# Altium project Tx_TFT_PCB.PrjPcb (part 1 of 2)
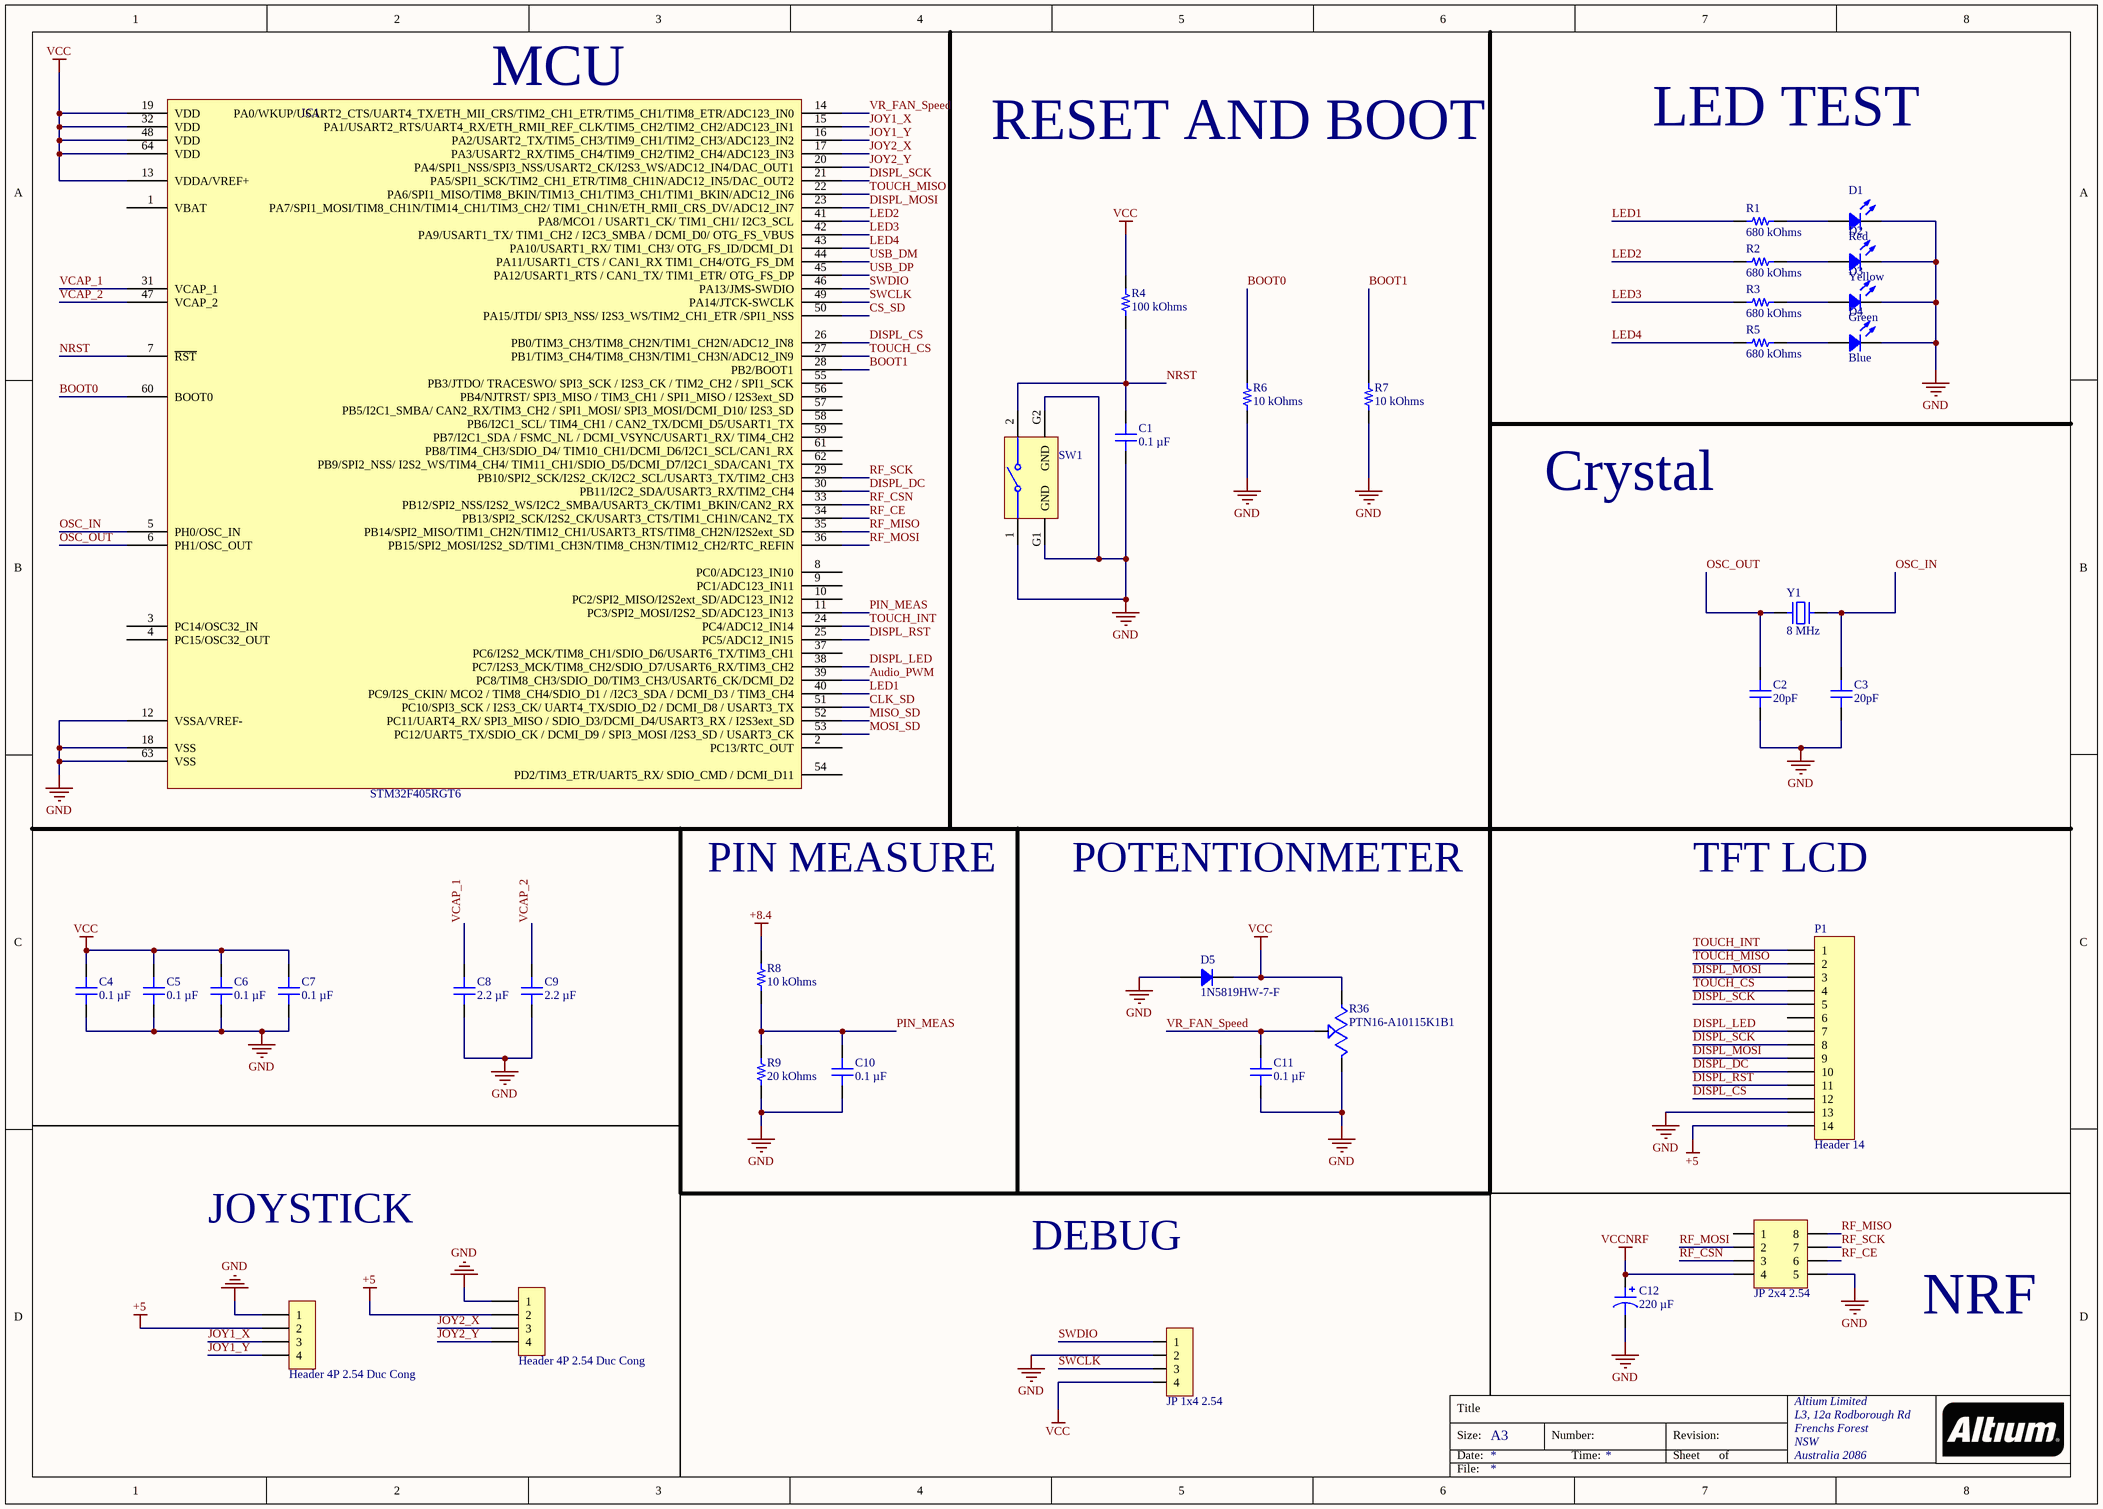
[diagram p0: MAIN_TX.SchDoc]
4 sheets, 107 parts. Net scope: global (net labels, ports and power ports of the same name join across sheets).
Board files: TX_PCB.PcbDoc, OFFICIAL_TX.PcbDoc
Sheets:
  MAIN_TX.SchDoc
  Audio.SchDoc
  Power_2.SchDoc
  USB_C.SchDoc

## Sheet MAIN_TX.SchDoc
size A3; Organization: Altium Limited; Address1: L3, 12a Rodborough Rd; Address2: Frenchs Forest; Address3: NSW; Address4: Australia 2086

### Parts
C1  0.1 µF  [CAP 0603_1608]
C2  20pF  [CAP 0603_1608]
C3  20pF  [CAP 0603_1608]
C4  0.1 µF  [CAP 0603_1608]
C5  0.1 µF  [CAP 0603_1608]
C6  0.1 µF  [CAP 0603_1608]
C7  0.1 µF  [CAP 0603_1608]
C8  2.2 µF  [CAP 0603_1608]
C9  2.2 µF  [CAP 0603_1608]
C10  0.1 µF  [CAP 0603_1608]
C11  0.1 µF  [CAP 0603_1608]
C12  220 µF  [CAP ALSMD 6.6MM H6.1MM]
D1  Red  [LED 0603_1608 RED]
D2  Yellow  [LED 0603_1608 YELLOW]
D3  Green  [LED 0603_1608 GREEN]
D4  Blue  [LED 0603_1608 BLUE]
D5  1N5819HW-7-F  [SOD-123]
H2  Header 4P 2.54 Duc Cong  [Header 4P DC 2.54]
H3  Header 4P 2.54 Duc Cong  [Header 4P DC 2.54]
IC1  STM32F405RGT6  [ST LQFP-64 10X10MM]
JP1  JP 2x4 2.54  [JP 2x4 CT]
JP4  JP 1x4 2.54  [JP 1x4 CC]
P1  Header 14  [HDR1X14]
R1  680 kOhms  [RES 0603_1608]
R2  680 kOhms  [RES 0603_1608]
R3  680 kOhms  [RES 0603_1608]
R4  100 kOhms  [RES 0603_1608]
R5  680 kOhms  [RES 0603_1608]
R6  10 kOhms  [RES 0603_1608]
R7  10 kOhms  [RES 0603_1608]
R8  10 kOhms  [RES 0603_1608]
R9  20 kOhms  [RES 0603_1608]
R36  PTN16-A10115K1B1  [POT_PTN16-A10115K1B1]
SW1  431256083716  [4312560837x6]  (value not drawn)
Y1  8 MHz  [NDK NX5032GA]

### Nets
+5: H2.2 H3.2 P1.14
+8.4: R8.2
GND: C1.1 C2.1 C3.1 C4.1 C5.1 C6.1 C7.1 C8.1 C9.1 C10.1 C11.1 C12.2 D1.2 D2.2 D3.2 D4.2 D5.1 H2.1 H3.1 IC1.12(VSSA/VREF-) IC1.18(VSS) IC1.63(VSS) JP1.5 JP4.2 P1.13 R6.1 R7.1 R9.1 R36.3 SW1.1 SW1.G1(GND) SW1.G2(GND)
VCC: C4.2 C5.2 C6.2 C7.2 D5.2 IC1.13(VDDA/VREF+) IC1.19(VDD) IC1.32(VDD) IC1.48(VDD) IC1.64(VDD) JP4.4 R4.2 R36.1
VCCNRF: C12.1 JP1.4
Audio_PWM: IC1.39(PC8/TIM8_CH3/SDIO_D0/TIM3_CH3/USART6_CK/DCMI_D2)
BOOT0: IC1.60(BOOT0) R6.2
BOOT1: IC1.28(PB2/BOOT1) R7.2
CLK_SD: IC1.51(PC10/SPI3_SCK_/_I2S3_CK/_UART4_TX/SDIO_D2_/_DCMI_D8_/_USART3_TX)
CS_SD: IC1.50(PA15/JTDI/_SPI3_NSS/_I2S3_WS/TIM2_CH1_ETR_/SPI1_NSS)
DISPL_CS: IC1.26(PB0/TIM3_CH3/TIM8_CH2N/TIM1_CH2N/ADC12_IN8) P1.12
DISPL_DC: IC1.30(PB11/I2C2_SDA/USART3_RX/TIM2_CH4) P1.10
DISPL_LED: IC1.38(PC7/I2S3_MCK/TIM8_CH2/SDIO_D7/USART6_RX/TIM3_CH2) P1.7
DISPL_MOSI: IC1.23(PA7/SPI1_MOSI/TIM8_CH1N/TIM14_CH1/TIM3_CH2/_TIM1_CH1N/ETH_RMII_CRS_DV/ADC12_IN7) P1.3 P1.9
DISPL_RST: IC1.25(PC5/ADC12_IN15) P1.11
DISPL_SCK: IC1.21(PA5/SPI1_SCK/TIM2_CH1_ETR/TIM8_CH1N/ADC12_IN5/DAC_OUT2) P1.5 P1.8
JOY1_X: H3.3 IC1.15(PA1/USART2_RTS/UART4_RX/ETH_RMII_REF_CLK/TIM5_CH2/TIM2_CH2/ADC123_IN1)
JOY1_Y: H3.4 IC1.16(PA2/USART2_TX/TIM5_CH3/TIM9_CH1/TIM2_CH3/ADC123_IN2)
JOY2_X: H2.3 IC1.17(PA3/USART2_RX/TIM5_CH4/TIM9_CH2/TIM2_CH4/ADC123_IN3)
JOY2_Y: H2.4 IC1.20(PA4/SPI1_NSS/SPI3_NSS/USART2_CK/I2S3_WS/ADC12_IN4/DAC_OUT1)
LED1: IC1.40(PC9/I2S_CKIN/_MCO2_/_TIM8_CH4/SDIO_D1_/_/I2C3_SDA_/_DCMI_D3_/_TIM3_CH4) R1.1
LED2: IC1.41(PA8/MCO1_/_USART1_CK/_TIM1_CH1/_I2C3_SCL) R2.1
LED3: IC1.42(PA9/USART1_TX/_TIM1_CH2_/_I2C3_SMBA_/_DCMI_D0/_OTG_FS_VBUS) R3.1
LED4: IC1.43(PA10/USART1_RX/_TIM1_CH3/_OTG_FS_ID/DCMI_D1) R5.1
MISO_SD: IC1.52(PC11/UART4_RX/_SPI3_MISO_/_SDIO_D3/DCMI_D4/USART3_RX_/_I2S3ext_SD)
MOSI_SD: IC1.53(PC12/UART5_TX/SDIO_CK_/_DCMI_D9_/_SPI3_MOSI_/I2S3_SD_/_USART3_CK)
NRST: C1.2 IC1.7(~{RST}) R4.1 SW1.2
OSC_IN: C3.2 IC1.5(PH0/OSC_IN) Y1.2
OSC_OUT: C2.2 IC1.6(PH1/OSC_OUT) Y1.1
PIN_MEAS: C10.2 IC1.11(PC3/SPI2_MOSI/I2S2_SD/ADC123_IN13) R8.1 R9.2
RF_CE: IC1.34(PB13/SPI2_SCK/I2S2_CK/USART3_CTS/TIM1_CH1N/CAN2_TX) JP1.6
RF_CSN: IC1.33(PB12/SPI2_NSS/I2S2_WS/I2C2_SMBA/USART3_CK/TIM1_BKIN/CAN2_RX) JP1.3
RF_MISO: IC1.35(PB14/SPI2_MISO/TIM1_CH2N/TIM12_CH1/USART3_RTS/TIM8_CH2N/I2S2ext_SD) JP1.8
RF_MOSI: IC1.36(PB15/SPI2_MOSI/I2S2_SD/TIM1_CH3N/TIM8_CH3N/TIM12_CH2/RTC_REFIN) JP1.2
RF_SCK: IC1.29(PB10/SPI2_SCK/I2S2_CK/I2C2_SCL/USART3_TX/TIM2_CH3) JP1.7
SWCLK: IC1.49(PA14/JTCK-SWCLK) JP4.3
SWDIO: IC1.46(PA13/JMS-SWDIO) JP4.1
TOUCH_CS: IC1.27(PB1/TIM3_CH4/TIM8_CH3N/TIM1_CH3N/ADC12_IN9) P1.4
TOUCH_INT: IC1.24(PC4/ADC12_IN14) P1.1
TOUCH_MISO: IC1.22(PA6/SPI1_MISO/TIM8_BKIN/TIM13_CH1/TIM3_CH1/TIM1_BKIN/ADC12_IN6) P1.2
USB_DM: IC1.44(PA11/USART1_CTS_/_CAN1_RX_TIM1_CH4/OTG_FS_DM)
USB_DP: IC1.45(PA12/USART1_RTS_/_CAN1_TX/_TIM1_ETR/_OTG_FS_DP)
VCAP_1: C8.2 IC1.31(VCAP_1)
VCAP_2: C9.2 IC1.47(VCAP_2)
VR_FAN_Speed: C11.2 IC1.14(PA0/WKUP/USART2_CTS/UART4_TX/ETH_MII_CRS/TIM2_CH1_ETR/TIM5_CH1/TIM8_ETR/ADC123_IN0) R36.2
NetD1_1: D1.1 R1.2
NetD2_1: D2.1 R2.2
NetD3_1: D3.1 R3.2
NetD4_1: D4.1 R5.2

Not connected (* = marked no-connect by the designer): IC1 1(VBAT) 2(PC13/RTC_OUT) 3(PC14/OSC32_IN) 4(PC15/OSC32_OUT) 8(PC0/ADC123_IN10) 9(PC1/ADC123_IN11) 10(PC2/SPI2_MISO/I2S2ext_SD/ADC123_IN12) 37(PC6/I2S2_MCK/TIM8_CH1/SDIO_D6/USART6_TX/TIM3_CH1) 54(PD2/TIM3_ETR/UART5_RX/_SDIO_CMD_/_DCMI_D11) 55(PB3/JTDO/_TRACESWO/_SPI3_SCK_/_I2S3_CK_/_TIM2_CH2_/_SPI1_SCK) 56(PB4/NJTRST/_SPI3_MISO_/_TIM3_CH1_/_SPI1_MISO_/_I2S3ext_SD) 57(PB5/I2C1_SMBA/_CAN2_RX/TIM3_CH2_/_SPI1_MOSI/_SPI3_MOSI/DCMI_D10/_I2S3_SD) 58(PB6/I2C1_SCL/_TIM4_CH1_/_CAN2_TX/DCMI_D5/USART1_TX) 59(PB7/I2C1_SDA_/_FSMC_NL_/_DCMI_VSYNC/USART1_RX/_TIM4_CH2) 61(PB8/TIM4_CH3/SDIO_D4/_TIM10_CH1/DCMI_D6/I2C1_SCL/CAN1_RX) 62(PB9/SPI2_NSS/_I2S2_WS/TIM4_CH4/_TIM11_CH1/SDIO_D5/DCMI_D7/I2C1_SDA/CAN1_TX); JP1 1; P1 6

### Notes on the sheet
- (near IC1) MCU
- RESET AND BOOT
- LED TEST
- Crystal
- PIN MEASURE
- POTENTIONMETER
- TFT LCD
- JOYSTICK
- DEBUG
- NRF
- Title
- Size:
- Date:
- A3
- Number:
- Time:
- Revision:
- Sheet
- of
- File:

### Library data of the parts
C1 C4-C7 = VJ0603Y104MXQCW1BC: CAP CER 0.1UF 10V X7R 0603; manufacturer: Vishay Vitramon; Tolerance: ±20%; Part Number: VJ0603Y104MXQCW1BC; Value: 0.1 µF; Applications: General Purpose; Capacitance: 0.1 µF; componentlink1description: Datasheet; componentlink1url: https://www.vishay.com/docs/28548/vjw1bcbascomseries.pdf; componentlink2description: DigiKey Link; componentlink2url: https://www.digikey.com/en/products/detail/vishay-vitramon/VJ0603Y104MXQCW1BC/8305323; Device Package: 0603 (1608 Metric); lastupdated: 2/9/2024 8:09:54 PM; Lifecycle Status: Active; Minimum Order: 1; Mounting Type: Surface Mount, MLCC; Operating Temperature: -55°C ~ 125°C; Package / Case: 0603 (1608 Metric); packaging: TapeAndReel; partid: 34594; Part Status: Active; price: 0.01; series: VJ W1BC; Size / Dimension: 0.063" L x 0.031" W (1.60mm x 0.80mm); Supplier 1: DigiKey; Supplier Part Number 1: 720-VJ0603Y104MXQCW1BCCT-ND; Temperature Coefficient: X7R; Thickness (Max): 0.034" (0.87mm); Voltage - Rated: 10V
C2 C3 = 0603YA200JAT2A: CAP CER 20PF 16V NP0 0603; manufacturer: AVX Corporation; Temperature Coefficient: C0G, NP0; Tolerance: ±5%; Part Number: 0603YA200JAT2A; Value: 20pF; Applications: General Purpose; Capacitance: 20pF; componentlink1description: Datasheet; componentlink1url: http://datasheets.avx.com/C0GNP0-Dielectric.pdf; componentlink2description: DigiKey Link; componentlink2url: http://digikey.com/product-detail/en/avx-corporation/0603YA200JAT2A/478-12745-1-ND/9949273; Device Package: 0603 (1608 Metric); lastupdated: 9/2/2020 1:02:56 AM; Lifecycle Status: Active; Minimum Order: 1; Mounting Type: Surface Mount, MLCC; Operating Temperature: -55°C ~ 125°C; Package / Case: 0603 (1608 Metric); packaging: TapeAndReel; partid: 26196; Part Status: Active; price: 0.07; series: -; Supplier 1: DigiKey; Supplier Part Number 1: 478-12745-1-ND; Voltage - Rated: 16V
C8 C9 = LMK107B7225MA-TR: CAP CER 2.2UF 10V X7R 0603; manufacturer: Taiyo Yuden; Tolerance: ±20%; Part Number: LMK107B7225MA-TR; Value: 2.2 µF; Applications: SMPS Filtering; Capacitance: 2.2 µF; componentlink1description: Datasheet; componentlink1url: https://ds.yuden.co.jp/TYCOMPAS/ut/detail?pn=LMK107B7225MA-TR &u=M; componentlink2description: DigiKey Link; componentlink2url: https://www.digikey.com/en/products/detail/taiyo-yuden/LMK107B7225MA-TR/7403930; Device Package: 0603 (1608 Metric); lastupdated: 2/9/2024 8:10:29 PM; Lifecycle Status: Active; Minimum Order: 1; Mounting Type: Surface Mount, MLCC; Operating Temperature: -55°C ~ 125°C; Package / Case: 0603 (1608 Metric); packaging: TapeAndReel; partid: 3009; Part Status: Active; price: 0.02; series: M; Size / Dimension: 0.063" L x 0.031" W (1.60mm x 0.80mm); Supplier 1: DigiKey; Supplier Part Number 1: 587-6286-1-ND; Temperature Coefficient: X7R; Thickness (Max): 0.020" (0.50mm); Voltage - Rated: 10V
C10 C11 = VJ0603Y104KXQCW1BC: CAP CER 0.1UF 10V X7R 0603; manufacturer: Vishay Vitramon; Tolerance: ±10%; Part Number: VJ0603Y104KXQCW1BC; Value: 0.1 µF; Applications: General Purpose; Capacitance: 0.1 µF; componentlink1description: Datasheet; componentlink1url: https://www.vishay.com/docs/28548/vjw1bcbascomseries.pdf; componentlink2description: DigiKey Link; componentlink2url: https://www.digikey.com/en/products/detail/vishay-vitramon/VJ0603Y104KXQCW1BC/8305317; Device Package: 0603 (1608 Metric); lastupdated: 2/9/2024 8:10:06 PM; Lifecycle Status: Active; Minimum Order: 1; Mounting Type: Surface Mount, MLCC; Operating Temperature: -55°C ~ 125°C; Package / Case: 0603 (1608 Metric); packaging: TapeAndReel; partid: 17766; Part Status: Active; price: 0.02; series: VJ W1BC; Size / Dimension: 0.063" L x 0.031" W (1.60mm x 0.80mm); Supplier 1: DigiKey; Supplier Part Number 1: 720-1689-1-ND; Temperature Coefficient: X7R; Thickness (Max): 0.034" (0.87mm); Voltage - Rated: 10V
C12 = UCM1A221MCL1GS: CAP ALUM 220UF 20% 10V SMD; manufacturer: Nichicon; Impedance: 260 mOhms; Lifetime @ Temp.: 2000 Hrs @ 105°C; Polarization: Polar; Ripple Current @ High Frequency: 300 mA @ 100 kHz; Ripple Current @ Low Frequency: 150 mA @ 120 Hz; Surface Mount Land Size: 0.260" L x 0.260" W (6.60mm x 6.60mm); Part Number: UCM1A221MCL1GS; Applications: Automotive; Capacitance: 220 µF; componentlink1description: Datasheet; componentlink1url: http://nichicon-us.com/english/products/pdfs/e-ucm.pdf; componentlink2description: DigiKey Link; componentlink2url: https://www.digikey.com/en/products/detail/nichicon/UCM1A221MCL1GS/4991832; Device Package: Radial, Can - SMD; Height - Seated (Max): 0.240" (6.10mm); lastupdated: 6/3/2024 8:16:09 PM; Lifecycle Status: Active; Minimum Order: 1; Mounting Type: Surface Mount; Operating Temperature: -55°C ~ 105°C; Package / Case: Radial, Can - SMD; packaging: TapeAndReel; partid: 27599; Part Status: Active; price: 0.13; Ratings: AEC-Q200; series: UCM; Size / Dimension: 0.248" Dia (6.30mm); Supplier 1: DigiKey; Supplier Part Number 1: 493-17470-1-ND; Tolerance: ±20%; value: 220 µF; Voltage - Rated: 10 V
D1 = 5973035507F: LED RED 0603 SMD; Manufacturer: Dialight; Configuration: Standard; Current - Test: 20mA; Lens Color: 0.68mm; Lens Size: 1.20mm x 0.80mm; Lens Style: Rectangle with Flat Top; Millicandela Rating: 112mcd; Voltage - Forward (Vf) (Typ): 2V; Wavelength - Dominant: 620nm; Part Number: 5973035507F; Color: Red; ComponentLink1Description: Datasheet; ComponentLink1URL: http://www.dialightsignalsandcomponents.com/Assets/Drawings/2D_Drawings_DrawingDetailedSpec/NewDrawings/18369A.pdf; ComponentLink2Description: DigiKey Link; ComponentLink2URL: https://www.digikey.com/en/products/detail/dialight/5973035507F/9385430; Device Package: 0603 (1608 Metric); Height (Max): 0.68mm; LastUpdated: 6/3/2024 7:59:48 PM; Lifecycle Status: Active; Minimum Order: 1; Mounting Type: Surface Mount; Package / Case: 0603 (1608 Metric); Packaging: TapeAndReel; PartId: 379; Part Status: Active; Price: 0.08; Series: 597; Size / Dimension: 1.60mm L x 0.80mm W; Supplier 1: DigiKey; Supplier Part Number 1: 350-4375-1-ND; Supplier Device Package: 0603; Value: Red
D2 = SML-D13WWT86A: LED YELLOW 0603 SMD; Manufacturer: Rohm Semiconductor; Current - Test: 20mA; Lens Size: 1.20mm x 0.80mm; Lens Style: Rectangle with Flat Top; Millicandela Rating: 112mcd; Voltage - Forward (Vf) (Typ): 2.1V; Wavelength - Dominant: 587nm; Part Number: SML-D13WWT86A; Color: Yellow; ComponentLink1Description: Datasheet; ComponentLink1URL: https://fscdn.rohm.com/en/products/databook/datasheet/opto/led/chip_mono/sml-d13x-e.pdf; ComponentLink2Description: DigiKey Link; ComponentLink2URL: https://www.digikey.com/en/products/detail/rohm-semiconductor/SML-D13WWT86A/16285824; Device Package: 0603 (1608 Metric); Height (Max): 0.65mm; LastUpdated: 6/3/2024 8:01:07 PM; Lifecycle Status: Active; Minimum Order: 1; Mounting Type: Surface Mount; Package / Case: 0603 (1608 Metric); Packaging: TapeAndReel; PartId: 1157; Part Status: Active; Price: 0.10; Series: SML-D13x; Size / Dimension: 1.60mm L x 0.80mm W; Supplier 1: DigiKey; Supplier Part Number 1: 846-SML-D13WWT86ACT-ND; Supplier Device Package: 0603; Value: Yellow
D3 = QBLP601-IG: LED GREEN CLEAR 0603 SMD; Manufacturer: QT Brightek (QTB); Configuration: Standard; Current - Test: 20mA; Lens Color: Colorless; Lens Size: 1.10mm x 0.80mm; Lens Style: Rectangle with Flat Top; Millicandela Rating: 450mcd; Viewing Angle: 140°; Voltage - Forward (Vf) (Typ): 3.2V; Wavelength - Dominant: 525nm; Part Number: QBLP601-IG; Color: Green; ComponentLink1Description: Datasheet; ComponentLink1URL: http://www.qt-brightek.com/datasheet/QBLP601_series.pdf; ComponentLink2Description: DigiKey Link; ComponentLink2URL: https://www.digikey.com/en/products/detail/qt-brightek-qtb/QBLP601-IG/4814653; Device Package: 0603 (1608 Metric); Height (Max): 0.60mm; LastUpdated: 6/3/2024 7:58:52 PM; Lens Transparency: Clear; Lifecycle Status: Active; Minimum Order: 1; Mounting Type: Surface Mount; Package / Case: 0603 (1608 Metric); Packaging: TapeAndReel; PartId: 668; Part Status: Active; Price: 0.06; Series: QBLP601; Size / Dimension: 1.60mm L x 0.80mm W; Supplier 1: DigiKey; Supplier Part Number 1: 1516-1055-1-ND; Supplier Device Package: 0603; Value: Green
D4 = VLMB1302-GS08: LED BLUE CLEAR 0603 SMD; Manufacturer: Vishay Semiconductor Opto Division; Current - Test: 20mA; Lens Color: Colorless; Lens Size: 1.10mm x 0.80mm; Lens Style: Rectangle with Flat Top; Millicandela Rating: 78.5mcd; Viewing Angle: 130°; Voltage - Forward (Vf) (Typ): 3.3V; Wavelength - Dominant: 470nm; Wavelength - Peak: 468nm; Part Number: VLMB1302-GS08; Color: Blue; ComponentLink1Description: Datasheet; ComponentLink1URL: https://www.vishay.com/docs/82437/vlmo1300.pdf; ComponentLink2Description: DigiKey Link; ComponentLink2URL: https://www.digikey.com/en/products/detail/vishay-semiconductor-opto-division/VLMB1302-GS08/20379912; Device Package: 0603 (1608 Metric); Height (Max): 0.90mm; LastUpdated: 6/3/2024 7:57:46 PM; Lens Transparency: Clear; Lifecycle Status: Active; Minimum Order: 1; Mounting Type: Surface Mount; Package / Case: 0603 (1608 Metric); Packaging: TapeAndReel; PartId: 1429; Price: 0.07; Series: ChipLED; Size / Dimension: 1.60mm L x 0.80mm W; Supplier 1: DigiKey; Supplier Part Number 1: 751-VLMB1302-GS08CT-ND; Supplier Device Package: 0603; Value: Blue
D5 = 1N5819HW-7-F: DIODE SCHOTTKY 40V 1A SOD123; Manufacturer: Diodes Incorporated; Capacitance @ Vr, F: 60pF @ 4V, 1MHz; Current - Reverse Leakage @ Vr: 1 mA @ 40 V; Speed: Fast Recovery =< 500ns, > 200mA (Io); Voltage - Forward (Vf) (Max) @ If: 450 mV @ 1 A; Part Number: 1N5819HW-7-F; ComponentLink1Description: Datasheet; ComponentLink1URL: https://www.diodes.com/assets/Datasheets/ds30217.pdf; ComponentLink2Description: DigiKey Link; ComponentLink2URL: https://www.digikey.com/en/products/detail/diodes-incorporated/1N5819HW-7-F/814970; Current - Average Rectified (Io): 1A; Diode Type: Schottky; LastUpdated: 6/3/2024 7:54:46 PM; Lifecycle Status: Active; Minimum Order: 1; Mounting Type: Surface Mount; Operating Temperature - Junction: -65°C ~ 125°C; Package / Case: SOD-123; Packaging: TapeAndReel; PartId: 2212; Part Status: Active; Price: 0.05; Series: -; Supplier 1: DigiKey; Supplier Part Number 1: 1N5819HW-FDICT-ND; Supplier Device Package: SOD-123; Voltage - DC Reverse (Vr) (Max): 40 V
H2 H3 = Header 4P 2.54 Duc Cong: Cắm; Ten_Linh_Kien: Header 4P XH2.54-4P Đực Cong; Don_Vi: Con; Ma_Hang: MH001310; Chung_Loai: Cắm
IC1 = STM32F405RGT6: IC MCU 32BIT 1MB FLASH 64LQFP; Manufacturer: STMicroelectronics; Connectivity: CANbus, I²C, IrDA, LINbus, SPI, UART/USART, USB OTG; Core Processor: ARM® Cortex®-M4; Core Size: 32-Bit; Data Converters: A/D 16x12b; D/A 2x12b; Number of I/O: 51; Oscillator Type: Internal; Peripherals: Brown-out Detect/Reset, DMA, I²S, LCD, POR, PWM, WDT; Program Memory Size: 1MB (1M x 8); RAM Size: 192K x 8; Speed: 168MHz; Voltage - Supply (Vcc/Vdd): 1.8V ~ 3.6V; Part Number: STM32F405RGT6; ComponentLink1Description: Datasheet; ComponentLink1URL: http://www.st.com/content/ccc/resource/technical/document/datasheet/ef/92/76/6d/bb/c2/4f/f7/DM00037051.pdf/files/DM00037051.pdf/jcr:content/translations/en.DM00037051.pdf; ComponentLink2Description: DigiKey Link; ComponentLink2URL: //digikey.com/product-detail/en/stmicroelectronics/STM32F405RGT6/497-11767-ND/2754208; Device Package: 64-LQFP; LastUpdated: 12/5/2019 11:44:20 PM; Lifecycle Status: 0; Minimum Order: 1; Mounting Type: Surface Mount; Operating Temperature: -40°C ~ 85°C (TA); Package / Case: 64-LQFP; Packaging: Tray; PartId: 115; Part Status: Active; Price: 10.30; Program Memory Type: FLASH; Series: STM32F4; Supplier 1: DigiKey; Supplier Part Number 1: 497-11767-ND; Supplier Device Package: 64-LQFP (10x10)
JP1 = JP 2x4 2.54 Cai Thang: Cắm; Ten_Linh_Kien: Jump Đôi Cái 2.54MM 2x20P Thẳng; Don_Vi: Con; Ma_Hang: MH008647; Ghi_Chu: *; Kieu_Chan: *; Chung_Loai: Cắm
JP4 = JP 1x4 2.54 Cai Cong: Cắm; Ten_Linh_Kien: Jump Đơn Cái 2.54MM 1x40P Cong; Don_Vi: Con; Ma_Hang: MH001265; Ghi_Chu: *; Kieu_Chan: *; Chung_Loai: Cắm
P1 = Header 14: Header, 14-Pin; LatestRevisionDate: 17-Jul-2002; LatestRevisionNote: Re-released for DXP Platform.; Publisher: Altium Limited
R1-R3 R5 = RGT1608P-684-B-T5: RES 680 KOHM 0.1% 1/16W 0603; Manufacturer: Susumu; Power (Watts): 0.063W, 1/16W; Temperature Coefficient: ±25ppm/°C; Part Number: RGT1608P-684-B-T5; Value: 680 kOhms; ComponentLink1Description: Datasheet; ComponentLink1URL: https://www.susumu.co.jp/common/pdf/n_catalog_partition38_en.pdf; ComponentLink2Description: DigiKey Link; ComponentLink2URL: https://www.digikey.com/en/products/detail/susumu/RGT1608P-684-B-T5/9918331; Composition: Thin Film; Device Package: 0603 (1608 Metric); Features: Anti-Sulfur, Automotive AEC-Q200; Height - Seated (Max): 0.022" (0.55mm); LastUpdated: 2/9/2024 8:40:32 PM; Lifecycle Status: Active; Minimum Order: 1; Number of Terminations: 2; Operating Temperature: -55°C ~ 175°C; Package / Case: 0603 (1608 Metric); Packaging: TapeAndReel; PartId: 82080; Price: 0.12; Ratings: AEC-Q200; Resistance: 680 kOhms; Series: RGT; Size / Dimension: 0.063" L x 0.031" W (1.60mm x 0.80mm); Supplier 1: DigiKey; Supplier Part Number 1: 408-RGT1608P-684-B-T5CT-ND; Supplier Device Package: 0603; Tolerance: ±0.1%
R4 = MCT06030E1003BP100: RES SMD 100K OHM 0.1% 1/10W 0603; Manufacturer: Vishay Beyschlag; Power (Watts): 0.1W, 1/10W; Temperature Coefficient: ±15ppm/°C; Part Number: MCT06030E1003BP100; Value: 100 kOhms; ComponentLink1Description: Datasheet; ComponentLink1URL: http://www.vishay.com/docs/28700/mcx0x0xpre.pdf; ComponentLink2Description: DigiKey Link; ComponentLink2URL: http://digikey.com/product-detail/en/vishay-beyschlag/MCT06030E1003BP100/749-MCT06030E1003BP100CT-ND/10453897; Composition: Thin Film; Device Package: 0603 (1608 Metric); Features: Anti-Sulfur; Height - Seated (Max): 0.022" (0.55mm); LastUpdated: 2/9/2024 8:43:09 PM; Lifecycle Status: Active; Minimum Order: 1; Number of Terminations: 2; Operating Temperature: -55°C ~ 125°C; Package / Case: 0603 (1608 Metric); Packaging: TapeAndReel; PartId: 11916; Part Status: Active; Price: 0.26; Resistance: 100 kOhms; Series: MCT - Precision; Size / Dimension: 0.061" L x 0.033" W (1.55mm x 0.85mm); Supplier 1: DigiKey; Supplier Part Number 1: 749-MCT06030E1003BP100CT-ND; Supplier Device Package: 0603; Tolerance: ±0.1%
R6-R8 = MCT0603MD1002DP500: RES SMD 10K OHM 0.5% 0.15W 0603; Manufacturer: Vishay Beyschlag; Temperature Coefficient: ±25ppm/°C; Part Number: MCT0603MD1002DP500; Value: 10 kOhms; ComponentLink1Description: Datasheet; ComponentLink1URL: http://www.vishay.com/docs/28760/mcat_pro.pdf; ComponentLink2Description: DigiKey Link; ComponentLink2URL: http://digikey.com/product-detail/en/vishay-beyschlag/MCT0603MD1002DP500/MCT0603-10K-MDCT-ND/2092127; Composition: Thin Film; Device Package: 0603 (1608 Metric); Features: Anti-Sulfur, Automotive AEC-Q200; Height - Seated (Max): 0.022" (0.55mm); LastUpdated: 2/9/2024 8:42:58 PM; Lifecycle Status: Active; Minimum Order: 1; Number of Terminations: 2; Operating Temperature: -55°C ~ 175°C; Package / Case: 0603 (1608 Metric); Packaging: TapeAndReel; PartId: 14581; Part Status: Active; Power (Watts): 0.15W; Price: 0.04; Ratings: AEC-Q200; Resistance: 10 kOhms; Series: MCT AT - Professional; Size / Dimension: 0.061" L x 0.033" W (1.55mm x 0.85mm); Supplier 1: DigiKey; Supplier Part Number 1: MCT0603-10K-MDCT-ND; Supplier Device Package: 0603; Tolerance: ±0.5%
R9 = RG1608P-203-B-T5: RES SMD 20K OHM 0.1% 1/10W 0603; Manufacturer: Susumu; Power (Watts): 0.1W, 1/10W; Temperature Coefficient: ±25ppm/°C; Part Number: RG1608P-203-B-T5; Value: 20 kOhms; ComponentLink1Description: Datasheet; ComponentLink1URL: //media.digikey.com/pdf/Data%20Sheets/Susumu%20PDFs/RG_RM_RGH_Oct2012.pdf; ComponentLink2Description: DigiKey Link; ComponentLink2URL: https://www.digikey.com/en/products/detail/susumu/RG1608P-203-B-T5/1240507; Composition: Thin Film; Device Package: 0603 (1608 Metric); Features: Anti-Sulfur, Automotive AEC-Q200; Height - Seated (Max): 0.020" (0.50mm); LastUpdated: 2/9/2024 8:43:15 PM; Lifecycle Status: Active; Minimum Order: 1; Number of Terminations: 2; Operating Temperature: -55°C ~ 155°C; Package / Case: 0603 (1608 Metric); Packaging: TapeAndReel; PartId: 10176; Part Status: Active; Price: 0.05; Ratings: AEC-Q200; Resistance: 20 kOhms; Series: RG; Size / Dimension: 0.063" L x 0.031" W (1.60mm x 0.80mm); Supplier 1: DigiKey; Supplier Part Number 1: RG16P20.0KBCT-ND; Supplier Device Package: 0603; Tolerance: ±0.1%
R36 = PTN16-A10115K1B1: MF: {'manufacturer': u'CUI Devices'}; Package: None; Price: None; Value: *; MP: PTN16-A10115K1B1; Availability: Unavailable
SW1 = 431256083716: WS-TATU THT Tact Switch 6x6mm Right Angled Type with ground terminal, SPST-NO, 12VDC, 50mA, 160g; Manufacturer: Wurth Elektronik; Washable: No; ComponentLink1Description: Website Link; ComponentLink1URL: https://www.we-online.com/redexpert/article/431256083716?ad; ComponentLink2Description: Datasheet Link; ComponentLink2URL: https://www.we-online.com/redexpert/spec/431256083716?ad; Manufacturer Part Number: 431256083716; Category: Tact Switches; Match Code: WS-TATU; Mount: Through Hole; Operating Temperature Max: 85°C; Operating Temperature Min: -40°C; Packaging: Bulk; Length: 6mm; Width: 6mm; Height: 8.35mm; Circuit: SPST-NO; Contact Material: Stainless Steel; Contact Plating: Silver; Operation Force: 160g; Rated Current: 50mA; Rated Voltage: 12VDC; Terminal Material: Copper Alloy; Terminal Plating: Silver
Y1 = NX5032GA-8.000M-STD-CSU-1: CRYSTAL 8.0000MHZ 8PF SMD; Manufacturer: NDK America, Inc.; ESR (Equivalent Series Resistance): 300 Ohms; Frequency Stability: ±150ppm; Frequency Tolerance: ±50ppm; Operating Mode: Fundamental; Part Number: NX5032GA-8.000M-STD-CSU-1; ComponentLink1Description: Datasheet; ComponentLink1URL: //media.digikey.com/pdf/Data%20Sheets/NDK%20PDFs/NX5032GA_STD-CSU-1,-2.pdf; ComponentLink2Description: DigiKey Link; ComponentLink2URL: https://www.digikey.com/en/products/detail/ndk-america-inc/NX5032GA-8-000M-STD-CSU-1/1788472; Frequency: 8 MHz; Height - Seated (Max): 0.059" (1.50mm); LastUpdated: 6/3/2024 8:02:22 PM; Lifecycle Status: Active; Load Capacitance: 8pF; Minimum Order: 1; Mounting Type: Surface Mount; Operating Temperature: -40°C ~ 150°C; Package / Case: 2-SMD, No Lead; Packaging: TapeAndReel; PartId: 627; Part Status: Active; Price: 0.32; Ratings: AEC-Q200; Series: NX5032GA; Size / Dimension: 0.197" L x 0.126" W (5.00mm x 3.20mm); Supplier 1: DigiKey; Supplier Part Number 1: 644-1132-1-ND; Type: MHz Crystal; Value: 8 MHz

## Sheet Audio.SchDoc
size A4; Organization: Altium Limited; Address1: L3, 12a Rodborough Rd; Address2: Frenchs Forest; Address3: NSW; Address4: Australia 2086
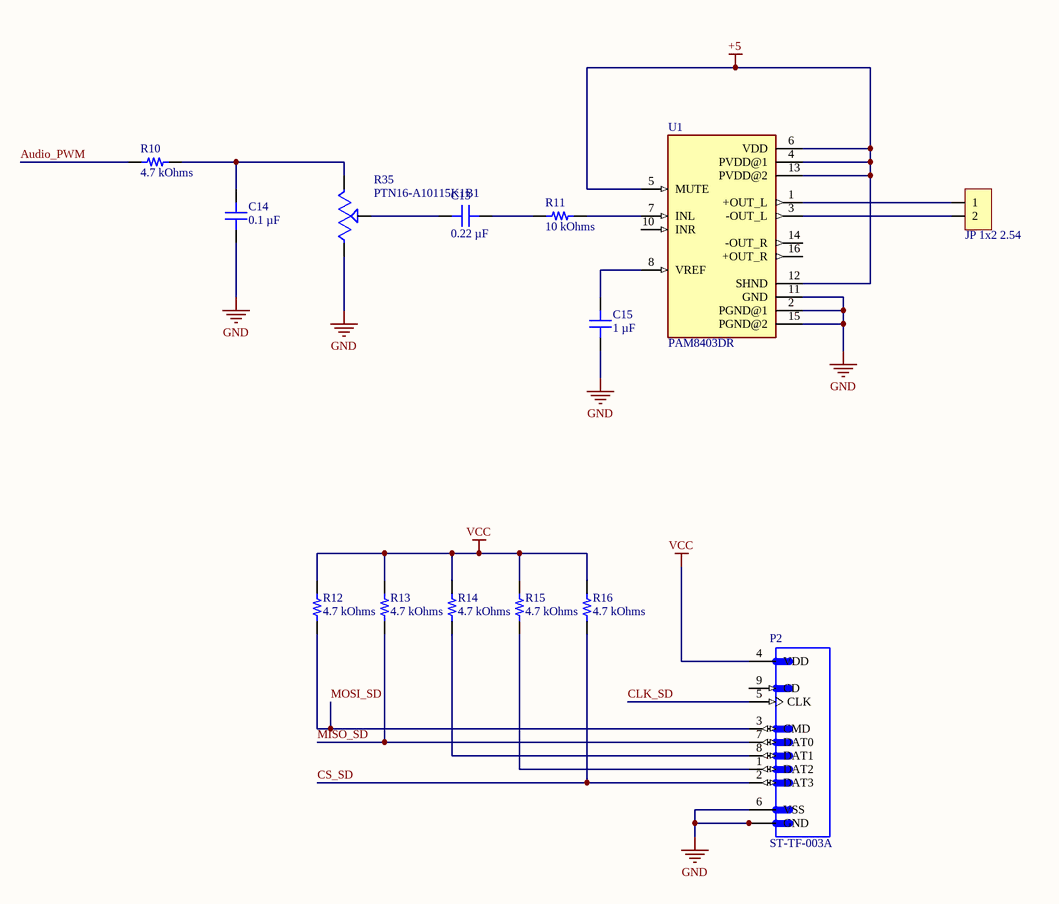
[diagram p1: Audio.SchDoc]

### Parts
C13  0.22 µF  [CAP 0603_1608]
C14  0.1 µF  [CAP 0603_1608]
C15  1 µF  [CAP 0603_1608]
JP5  JP 1x2 2.54  [JP 1x2 CT]
P2  ST-TF-003A  [SUNTECH_ST-TF-003A]
R10  4.7 kOhms  [RES 0603_1608]
R11  10 kOhms  [RES 0603_1608]
R12  4.7 kOhms  [RES 0603_1608]
R13  4.7 kOhms  [RES 0603_1608]
R14  4.7 kOhms  [RES 0603_1608]
R15  4.7 kOhms  [RES 0603_1608]
R16  4.7 kOhms  [RES 0603_1608]
R35  PTN16-A10115K1B1  [POT_PTN16-A10115K1B1]
U1  PAM8403DR  [SOIC127P605X150-16N]

### Nets
+5: U1.4(PVDD@1) U1.5(MUTE) U1.6(VDD) U1.12(SHND) U1.13(PVDD@2)
GND: C14.1 C15.1 P2.6(VSS) P2.G1(GND) P2.G2(GND) P2.G3(GND) P2.G4(GND) R35.1 U1.2(PGND@1) U1.11(GND) U1.15(PGND@2)
VCC: P2.4(VDD) R12.2 R13.2 R14.2 R15.2 R16.2
Audio_PWM: R10.1
CLK_SD: P2.5(CLK)
CS_SD: P2.2(DAT3) R16.1
MISO_SD: P2.7(DAT0) R13.1
MOSI_SD: P2.3(CMD) R12.1
NetC13_1: C13.1 R35.2
NetC13_2: C13.2 R11.1
NetC14_2: C14.2 R10.2 R35.3
NetC15_2: C15.2 U1.8(VREF)
NetJP5_1: JP5.1 U1.1(+OUT_L)
NetJP5_2: JP5.2 U1.3(-OUT_L)
NetP2_1: P2.1(DAT2) R15.1
NetP2_8: P2.8(DAT1) R14.1
NetR11_2: R11.2 U1.7(INL)

Not connected (* = marked no-connect by the designer): P2 9(CD); U1 10(INR) 14(-OUT_R) 16(+OUT_R)

### Notes on the sheet
- Title
- Size:
- Date:
- A4
- Number:
- Time:
- Revision:
- Sheet
- of
- File:

### Library data of the parts
C13 = KGM15BR71A224MT: CAP CER 0.22UF 10V X7R 0603; manufacturer: KYOCERA AVX; Tolerance: ±20%; Part Number: KGM15BR71A224MT; Value: 0.22 µF; Applications: General Purpose; Capacitance: 0.22 µF; componentlink1description: Datasheet; componentlink1url: https://datasheets.kyocera-avx.com/X7RDielectric.pdf; componentlink2description: DigiKey Link; componentlink2url: https://www.digikey.com/en/products/detail/kyocera-avx/KGM15BR71A224MT/1116255; Device Package: 0603 (1608 Metric); lastupdated: 2/9/2024 8:09:12 PM; Lifecycle Status: Active; Minimum Order: 1; Mounting Type: Surface Mount, MLCC; Operating Temperature: -55°C ~ 125°C; Package / Case: 0603 (1608 Metric); packaging: TapeAndReel; partid: 53200; Part Status: Active; price: 0.05; series: KGM - X7R; Size / Dimension: 0.063" L x 0.032" W (1.60mm x 0.81mm); Supplier 1: DigiKey; Supplier Part Number 1: 478-KGM15BR71A224MTCT-ND; Temperature Coefficient: X7R; Thickness (Max): 0.037" (0.95mm); Voltage - Rated: 10V
C14 = CX0603MRX7R6BB104: CAP CER 0.1UF 10V X7R 0603; manufacturer: PulseLarsen Antennas; Tolerance: ±20%; Part Number: CX0603MRX7R6BB104; Value: 0.1 µF; Applications: Bypass, Decoupling; Capacitance: 0.1 µF; componentlink1description: Datasheet; componentlink1url: https://productfinder.pulseelectronics.com/api/open/product-attachments/datasheet/cx0805mrx7r0bb102; componentlink2description: DigiKey Link; componentlink2url: https://www.digikey.com/en/products/detail/pulselarsen-antennas/CX0603MRX7R6BB104/1219074; Device Package: 0603 (1608 Metric); Features: Low ESL (X2Y); lastupdated: 2/9/2024 8:09:55 PM; Lifecycle Status: Active; Minimum Order: 1; Mounting Type: Surface Mount, MLCC; Operating Temperature: -55°C ~ 125°C; Package / Case: 0603 (1608 Metric); packaging: TapeAndReel; partid: 34696; Part Status: Active; price: 0.09; series: X2Y®; Size / Dimension: 0.063" L x 0.033" W (1.60mm x 0.85mm); Supplier 1: DigiKey; Supplier Part Number 1: 311-1237-1-ND; Temperature Coefficient: X7R; Thickness (Max): 0.030" (0.75mm); Voltage - Rated: 10V
C15 = CM105X7R105M10AT: CAP CER 1UF 10V X7R 0603; manufacturer: KYOCERA AVX; Tolerance: ±20%; Part Number: CM105X7R105M10AT; Value: 1 µF; Applications: General Purpose; Capacitance: 1 µF; componentlink1description: Datasheet; componentlink1url: https://ele.kyocera.com/assets/products/capacitor/CM_Series_e.pdf; componentlink2description: DigiKey Link; componentlink2url: https://www.digikey.com/en/products/detail/kyocera-avx/CM105X7R105M10AT/10815023; Device Package: 0603 (1608 Metric); lastupdated: 2/9/2024 8:09:58 PM; Lifecycle Status: Active; Minimum Order: 1; Mounting Type: Surface Mount, MLCC; Operating Temperature: -55°C ~ 125°C; Package / Case: 0603 (1608 Metric); packaging: TapeAndReel; partid: 35538; Part Status: Active; price: 0.02; series: CM; Size / Dimension: 0.063" L x 0.031" W (1.60mm x 0.80mm); Supplier 1: DigiKey; Supplier Part Number 1: 478-CM105X7R105M10ATCT-ND; Temperature Coefficient: X7R; Thickness (Max): 0.035" (0.90mm); Voltage - Rated: 10V
JP5 = JP 1x2 2.54 Cai Thang: Cắm; Ten_Linh_Kien: Jump Đơn Cái 2.54MM 1x20P Thẳng; Don_Vi: Con; Ma_Hang: MH004006; Ghi_Chu: *; Kieu_Chan: *; Chung_Loai: Cắm
P2 = ST-TF-003A: Micro SD Card Socket; Price: None; MP: ST-TF-003A; Availability: Unavailable; Value: *; Package: None
R10 = ERA-3ARB472V: RES SMD 4.7K OHM 0.1% 1/10W 0603; Manufacturer: Panasonic Electronic Components; Power (Watts): 0.1W, 1/10W; Temperature Coefficient: ±10ppm/°C; Part Number: ERA-3ARB472V; Value: 4.7 kOhms; ComponentLink1Description: Datasheet; ComponentLink1URL: https://industrial.panasonic.com/cdbs/www-data/pdf/RDM0000/AOA0000C307.pdf; ComponentLink2Description: DigiKey Link; ComponentLink2URL: https://www.digikey.com/en/products/detail/panasonic-electronic-components/ERA-3ARB472V/3073667; Composition: Thin Film; Device Package: 0603 (1608 Metric); Features: Automotive AEC-Q200; Height - Seated (Max): 0.022" (0.55mm); LastUpdated: 2/9/2024 8:42:34 PM; Lifecycle Status: Active; Minimum Order: 1; Number of Terminations: 2; Operating Temperature: -55°C ~ 155°C; Package / Case: 0603 (1608 Metric); Packaging: TapeAndReel; PartId: 20792; Part Status: Active; Price: 0.15; Ratings: AEC-Q200; Resistance: 4.7 kOhms; Series: ERA-3A; Size / Dimension: 0.063" L x 0.031" W (1.60mm x 0.80mm); Supplier 1: DigiKey; Supplier Part Number 1: P4.7KBDCT-ND; Supplier Device Package: 0603; Tolerance: ±0.1%
R11 = MCT06030E1002BP100: RES SMD 10K OHM 0.1% 1/10W 0603; Manufacturer: Vishay Beyschlag; Power (Watts): 0.1W, 1/10W; Temperature Coefficient: ±15ppm/°C; Part Number: MCT06030E1002BP100; Value: 10 kOhms; ComponentLink1Description: Datasheet; ComponentLink1URL: http://www.vishay.com/docs/28700/mcx0x0xpre.pdf; ComponentLink2Description: DigiKey Link; ComponentLink2URL: http://digikey.com/product-detail/en/vishay-beyschlag/MCT06030E1002BP100/749-1718-1-ND/7348026; Composition: Thin Film; Device Package: 0603 (1608 Metric); Features: Anti-Sulfur; Height - Seated (Max): 0.022" (0.55mm); LastUpdated: 2/9/2024 8:42:57 PM; Lifecycle Status: Active; Minimum Order: 1; Number of Terminations: 2; Operating Temperature: -55°C ~ 125°C; Package / Case: 0603 (1608 Metric); Packaging: TapeAndReel; PartId: 15019; Part Status: Active; Price: 0.26; Resistance: 10 kOhms; Series: MCT - Precision; Size / Dimension: 0.061" L x 0.033" W (1.55mm x 0.85mm); Supplier 1: DigiKey; Supplier Part Number 1: 749-1718-1-ND; Supplier Device Package: 0603; Tolerance: ±0.1%
R12-R16 = URG1608L-472-L-T05: RES SMD 4.7KOHM 0.01% 1/16W 0603; Manufacturer: Susumu; Power (Watts): 0.063W, 1/16W; Temperature Coefficient: ±2ppm/°C; Part Number: URG1608L-472-L-T05; Value: 4.7 kOhms; ComponentLink1Description: Datasheet; ComponentLink1URL: http://www.susumu.co.jp/common/pdf/n_catalog_partition03_en.pdf; ComponentLink2Description: DigiKey Link; ComponentLink2URL: https://www.digikey.com/en/products/detail/susumu/URG1608L-472-L-T05/4552652; Composition: Thin Film; Device Package: 0603 (1608 Metric); Features: Anti-Sulfur, Automotive AEC-Q200; Height - Seated (Max): 0.022" (0.55mm); LastUpdated: 2/9/2024 8:43:04 PM; Lifecycle Status: Active; Minimum Order: 1; Number of Terminations: 2; Operating Temperature: -55°C ~ 155°C; Package / Case: 0603 (1608 Metric); Packaging: TapeAndReel; PartId: 13142; Part Status: Active; Price: 4.24; Ratings: AEC-Q200; Resistance: 4.7 kOhms; Series: URG; Size / Dimension: 0.063" L x 0.031" W (1.60mm x 0.80mm); Supplier 1: DigiKey; Supplier Part Number 1: 408-1772-1-ND; Supplier Device Package: 0603; Tolerance: ±0.01%
R35 = PTN16-A10115K1B1: MF: {'manufacturer': u'CUI Devices'}; Package: None; Price: None; Value: *; MP: PTN16-A10115K1B1; Availability: Unavailable
U1 = PAM8403DR: Amplifier IC 2-Channel _Stereo_ Class D 16-SOP; MF: Diodes Inc.; MP: PAM8403DR; Availability: Unavailable; Package: SOP-16 Diodes Inc.; Value: *; Price: None; SnapEDA_Link: https://www.snapeda.com/parts/PAM8403DR/Diodes%20Inc./view-part/108087/?ref=snap